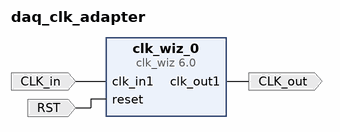
[diagram p0: block diagram of the top level]
# Vivado block design daq_clk_adapter, xc7a100tcsg324-1, Vivado 2020.2
create_bd_design daq_clk_adapter

create_bd_port -dir I CLK_in
create_bd_port -dir I RST
create_bd_port -dir O CLK_out

create_bd_cell -type ip -vlnv xilinx.com:ip:clk_wiz:6.0 clk_wiz_0
set_property -dict [list \
  CONFIG.CLKOUT1_JITTER 127.691 \
  CONFIG.CLKOUT1_PHASE_ERROR 97.646 \
  CONFIG.CLKOUT1_REQUESTED_OUT_FREQ 108 \
  CONFIG.MMCM_CLKFBOUT_MULT_F 10.125 \
  CONFIG.MMCM_CLKOUT0_DIVIDE_F 9.375 \
  CONFIG.USE_LOCKED false \
] [get_bd_cells clk_wiz_0]

# ---- connections ----

connect_bd_net [get_bd_ports CLK_in] [get_bd_pins clk_wiz_0/clk_in1]
connect_bd_net [get_bd_ports RST] [get_bd_pins clk_wiz_0/reset]
connect_bd_net [get_bd_pins clk_wiz_0/clk_out1] [get_bd_ports CLK_out]

validate_bd_design
save_bd_design
